# Altium schematic sheet Onju-Home.SchDoc
size A2; SheetNumber: 1; SheetTotal: 1
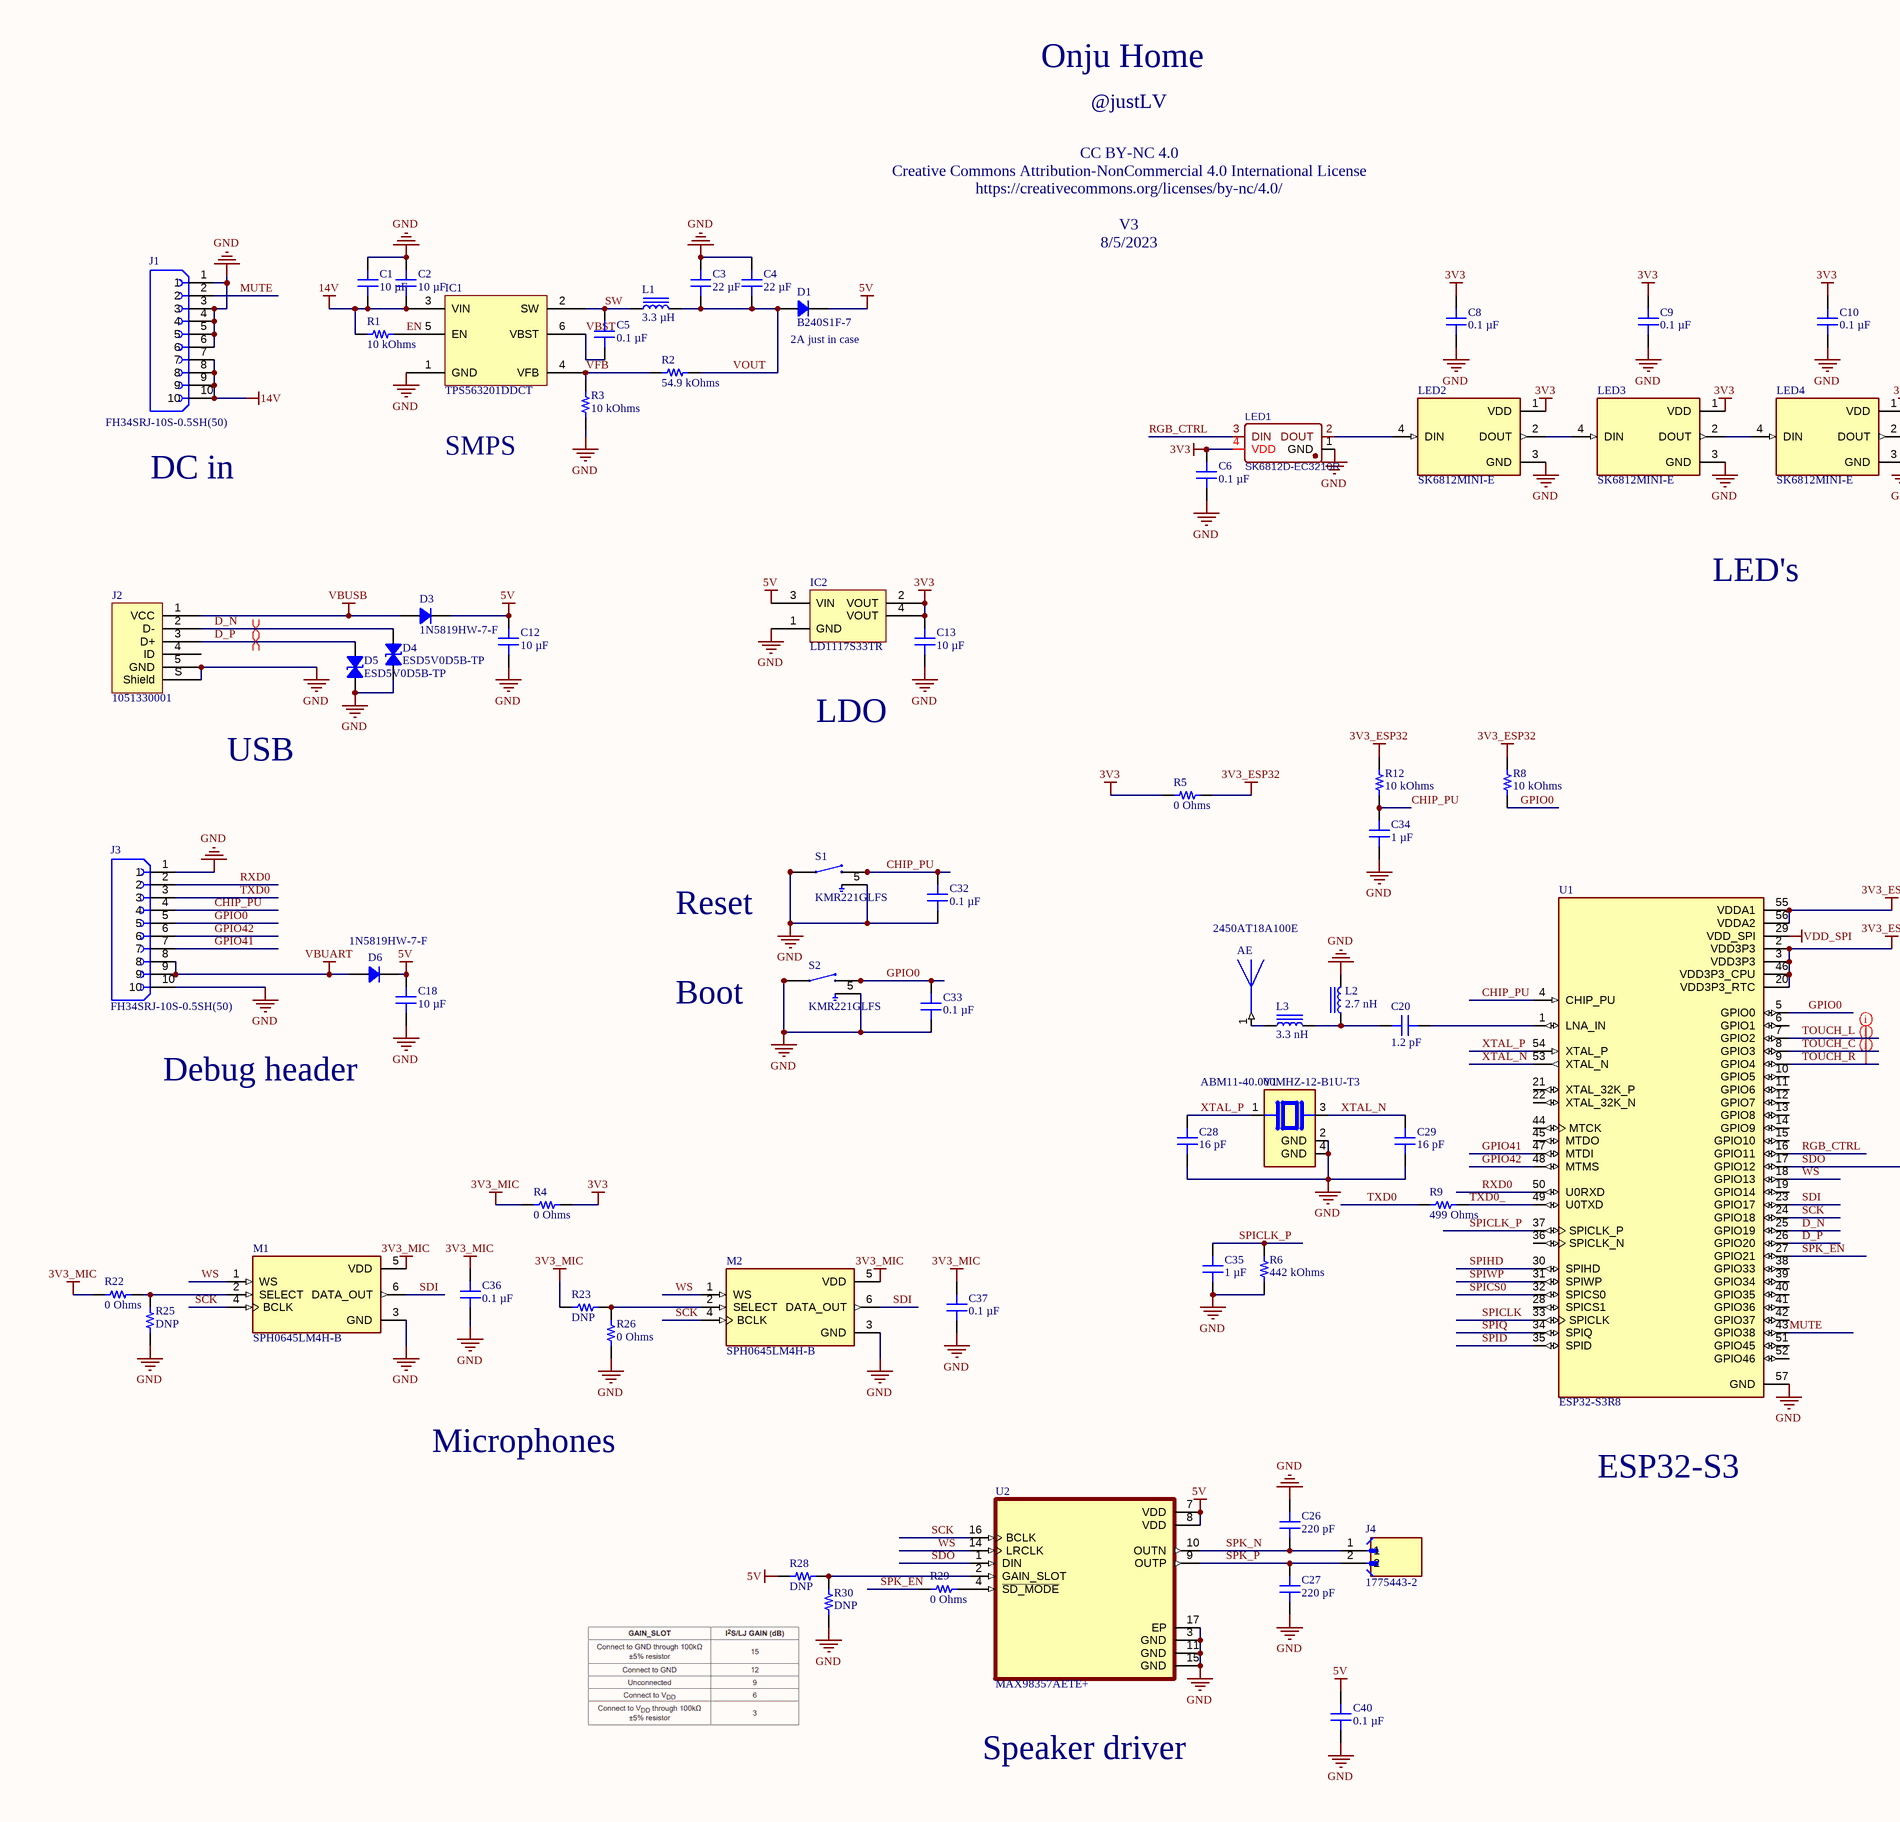
[diagram p0: Onju-Home.SchDoc, left]
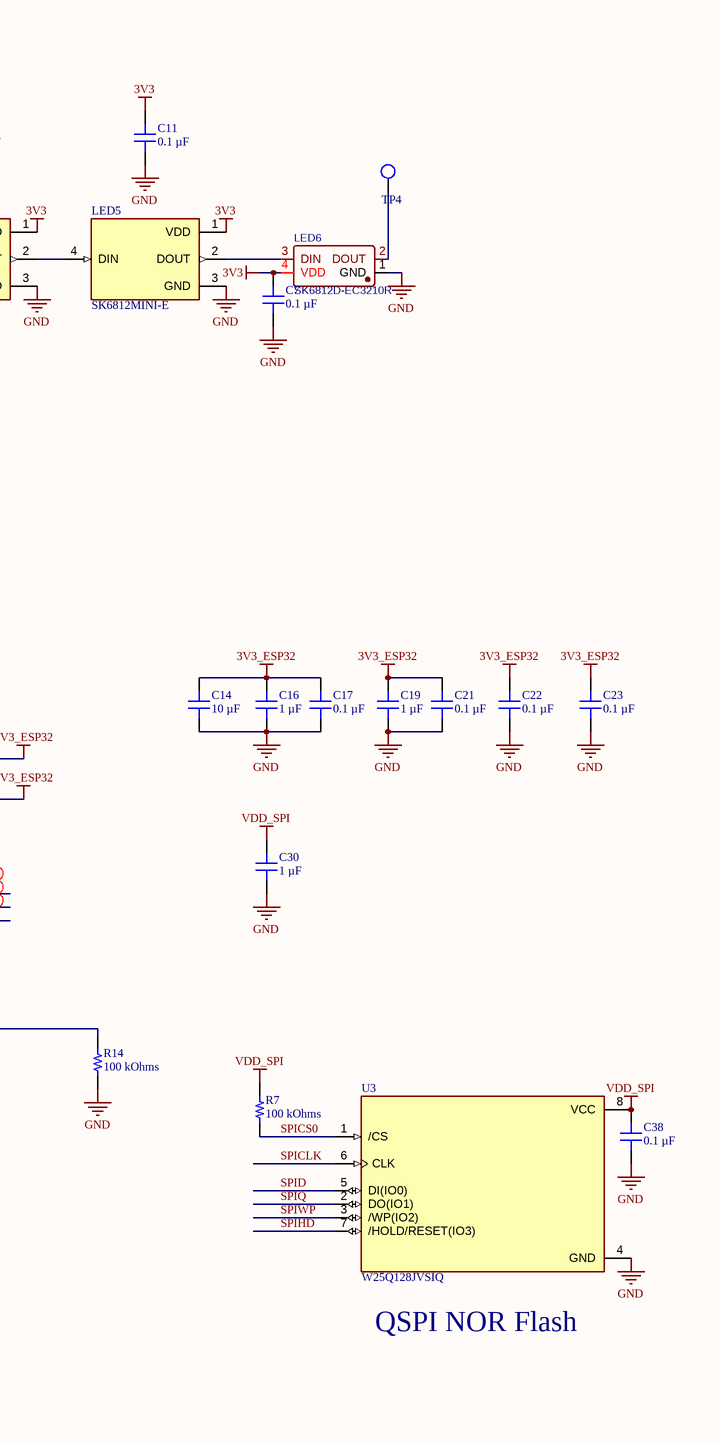
[diagram p1: Onju-Home.SchDoc, right]

## Parts
AE  2450AT18A100E  [ANTC3216X140N]
C1  10 µF  [CAP 0805_2012]
C2  10 µF  [CAP 0805_2012]
C3  22 µF  [CAP 0805_2012]
C4  22 µF  [CAP 0805_2012]
C5  0.1 µF  [CAP 0402_1005]
C6  0.1 µF  [CAP 0402_1005]
C7  0.1 µF  [CAP 0402_1005]
C8  0.1 µF  [CAP 0402_1005]
C9  0.1 µF  [CAP 0402_1005]
C10  0.1 µF  [CAP 0402_1005]
C11  0.1 µF  [CAP 0402_1005]
C12  10 µF  [CAP 0805_2012]
C13  10 µF  [CAP 0805_2012]
C14  10 µF  [CAP 0805_2012]
C16  1 µF  [CAP 0402_1005]
C17  0.1 µF  [CAP 0402_1005]
C18  10 µF  [CAP 0805_2012]
C19  1 µF  [CAP 0402_1005]
C20  1.2 pF  [CAP 0402_1005]
C21  0.1 µF  [CAP 0402_1005]
C22  0.1 µF  [CAP 0402_1005]
C23  0.1 µF  [CAP 0402_1005]
C26  220 pF  [CAP 0603_1608]
C27  220 pF  [CAP 0603_1608]
C28  16 pF  [CAP 0402_1005]
C29  16 pF  [CAP 0402_1005]
C30  1 µF  [CAP 0402_1005]
C32  0.1 µF  [CAP 0402_1005]
C33  0.1 µF  [CAP 0402_1005]
C34  1 µF  [CAP 0402_1005]
C35  1 µF  [CAP 0402_1005]
C36  0.1 µF  [CAP 0402_1005]
C37  0.1 µF  [CAP 0402_1005]
C38  0.1 µF  [CAP 0402_1005]
C40  0.1 µF  [CAP 0402_1005]
D1  B240S1F-7  [SOD123F]
D3  1N5819HW-7-F  [SOD-123]
D4  ESD5V0D5B-TP  [SOD523F]
D5  ESD5V0D5B-TP  [SOD523F]
D6  1N5819HW-7-F  [SOD-123]
IC1  TPS563201DDCT  [TI SOT-23-6 DDC]
IC2  LD1117S33TR  [ST SOT-223]
J1  FH34SRJ-10S-0.5SH(50)  [HRS_FH34SRJ-10S-0.5SH(50)]
J2  1051330001  [MOLEX 1051330001]
J3  FH34SRJ-10S-0.5SH(50)  [HRS_FH34SRJ-10S-0.5SH(50)]
J4  1775443-2  [TE_1775443-2]
L1  3.3 µH  [BOURNS SRN4018]
L2  2.7 nH  [IND 0402_1005 RF WW]
L3  3.3 nH  [IND 0402_1005 RF WW]
LED1  SK6812D-EC3210R  [LED-SMD_4P_SK6812D-EC3210R]
LED2  SK6812MINI-E  [LED_SK6812-E]
LED3  SK6812MINI-E  [LED_SK6812-E]
LED4  SK6812MINI-E  [LED_SK6812-E]
LED5  SK6812MINI-E  [LED_SK6812-E]
LED6  SK6812D-EC3210R  [LED-SMD_4P_SK6812D-EC3210R]
M1  SPH0645LM4H-B  [MIC_SPH0645LM4H-B]
M2  SPH0645LM4H-B  [MIC_SPH0645LM4H-B]
R1  10 kOhms  [RES 0603_1608]
R2  54.9 kOhms  [RES 0603_1608]
R3  10 kOhms  [RES 0603_1608]
R4  0 Ohms  [RES 0603_1608]
R5  0 Ohms  [RES 0603_1608]
R6  442 kOhms  [RES 0603_1608]
R7  100 kOhms  [RES 0603_1608]
R8  10 kOhms  [RES 0603_1608]
R9  499 Ohms  [RES 0402_1005]
R12  10 kOhms  [RES 0603_1608]
R14  100 kOhms  [RES 0603_1608]
R22  0 Ohms  [RES 0603_1608]
R23  DNP  [RES 0603_1608]  (no BOM)
R25  DNP  [RES 0603_1608]  (no BOM)
R26  0 Ohms  [RES 0603_1608]
R28  DNP  [RES 0603_1608]  (no BOM)
R29  0 Ohms  [RES 0603_1608]
R30  DNP  [RES 0603_1608]  (no BOM)
S1  KMR221GLFS  [SW_KMR221GLFS]
S2  KMR221GLFS  [SW_KMR221GLFS]
TP4  TP  [TP_1MM]  (value not drawn)  (no BOM)
U1  ESP32-S3R8  [QFN40P700X700X90-57N]
U2  MAX98357AETE+  [QFN50P300X300X80-17N]
U3  W25Q128JVSIQ  [SOIC127P790X216-8N]
Y1  ABM11-40.000MHZ-12-B1U-T3  [XTAL_ABM11-40.000MHZ-12-B1U-T3]

## Nets
3V3: C6.2 C7.2 C8.2 C9.2 C10.2 C11.2 C13.1 IC2.2(VOUT) IC2.4(VOUT) LED1.4(VDD) LED2.1(VDD) LED3.1(VDD) LED4.1(VDD) LED5.1(VDD) LED6.4(VDD) R4.2 R5.1
3V3_ESP32: C14.1 C16.2 C17.2 C19.2 C21.2 C22.2 C23.2 R5.2 R8.1 R12.1 U1.2(VDD3P3) U1.3(VDD3P3) U1.20(VDD3P3_RTC) U1.46(VDD3P3_CPU) U1.55(VDDA1) U1.56(VDDA2)
3V3_MIC: C36.2 C37.2 M1.5(VDD) M2.5(VDD) R4.1 R22.1 R23.2
5V: C12.1 C18.1 C40.2 D1.2 D3.2 D6.2 IC2.3(VIN) R28.2 U2.7(VDD) U2.8(VDD)
14V: C1.1 C2.1 IC1.3(VIN) J1.7 J1.8 J1.9 J1.10 R1.2
GND: C1.2 C2.2 C3.2 C4.2 C6.1 C7.1 C8.1 C9.1 C10.1 C11.1 C12.2 C13.2 C14.2 C16.1 C17.1 C18.2 C19.1 C21.1 C22.1 C23.1 C26.2 C27.1 C28.1 C29.1 C30.1 C32.1 C33.1 C34.1 C35.1 C36.1 C37.1 C38.1 C40.1 D4.1 D5.1 IC1.1(GND) IC2.1(GND) J1.1 J1.3 J1.4 J1.5 J1.6 J2.5(GND) J2.S(Shield) J3.1 J3.10 L2.2 LED1.1(GND) LED2.3(GND) LED3.3(GND) LED4.3(GND) LED5.3(GND) LED6.1(GND) M1.3(GND) M2.3(GND) R3.1 R6.1 R14.2 R25.1 R26.1 R30.1 S1.1 S1.4 S1.5 S2.1 S2.4 S2.5 U1.57(GND) U2.3(GND) U2.11(GND) U2.15(GND) U2.17(EP) U3.4(GND) Y1.2(GND) Y1.4(GND)
VBUART: D6.1 J3.8 J3.9
VBUSB: D3.1 J2.1(VCC)
VDD_SPI: C30.2 C38.2 R7.1 U1.29(VDD_SPI) U3.8(VCC)
CHIP_PU: C32.2 C34.2 J3.4 R12.2 S1.2 S1.3 U1.4(CHIP_PU)
D_N: D4.2 J2.2(D-) U1.25(GPIO19)
D_P: D5.2 J2.3(D+) U1.26(GPIO20)
EN: IC1.5(EN) R1.1
GPIO0: C33.2 J3.5 R8.2 S2.2 S2.3 U1.5(GPIO0)
GPIO41: J3.7 U1.47(MTDI)
GPIO42: J3.6 U1.48(MTMS)
MUTE: J1.2 U1.43(GPIO38)
RGB_CTRL: LED1.3(DIN) U1.16(GPIO11)
RXD0: J3.2 U1.50(U0RXD)
SCK: M1.4(BCLK) M2.4(BCLK) U1.24(GPIO18) U2.16(BCLK)
SDI: M1.6(DATA_OUT) M2.6(DATA_OUT) U1.23(GPIO17)
SDO: R14.1 U1.17(GPIO12) U2.1(DIN)
SPICLK: U1.33(SPICLK) U3.6(CLK)
SPICLK_P: C35.2 R6.2 U1.37(SPICLK_P)
SPICS0: R7.2 U1.32(SPICS0) U3.1(/CS)
SPID: U1.35(SPID) U3.5(DI(IO0))
SPIHD: U1.30(SPIHD) U3.7(/HOLD/RESET(IO3))
SPIQ: U1.34(SPIQ) U3.2(DO(IO1))
SPIWP: U1.31(SPIWP) U3.3(/WP(IO2))
SPK_EN: R29.1 U1.27(GPIO21)
SPK_N: C26.1 J4.1 U2.10(OUTN)
SPK_P: C27.2 J4.2 U2.9(OUTP)
SW: C5.2 IC1.2(SW) L1.1
TOUCH_C: U1.8(GPIO3)
TOUCH_L: U1.7(GPIO2)
TOUCH_R: U1.9(GPIO4)
TXD0: J3.3 R9.1
TXD0_: R9.2 U1.49(U0TXD)
VBST: C5.1 IC1.6(VBST)
VFB: IC1.4(VFB) R2.1 R3.2
VOUT: C3.1 C4.1 D1.1 L1.2 R2.2
WS: M1.1(WS) M2.1(WS) U1.18(GPIO13) U2.14(LRCLK)
XTAL_N: C29.2 U1.53(XTAL_N) Y1.3
XTAL_P: C28.2 U1.54(XTAL_P) Y1.1
NetAE_1: AE.1 L3.1
NetC20_1: C20.1 L2.1 L3.2
NetC20_2: C20.2 U1.1(LNA_IN)
NetLED1_2: LED1.2(DOUT) LED2.4(DIN)
NetLED2_2: LED2.2(DOUT) LED3.4(DIN)
NetLED3_2: LED3.2(DOUT) LED4.4(DIN)
NetLED4_2: LED4.2(DOUT) LED5.4(DIN)
NetLED5_2: LED5.2(DOUT) LED6.3(DIN)
NetLED6_2: LED6.2(DOUT) TP4.1
NetM1_2: M1.2(SELECT) R22.2 R25.2
NetM2_2: M2.2(SELECT) R23.1 R26.2
NetR28_1: R28.1 R30.2 U2.2(GAIN_SLOT)
NetR29_2: R29.2 U2.4(~{SD_MODE})

Not connected (* = marked no-connect by the designer): J2 4(ID); U1 6(GPIO1) 10(GPIO5) 11(GPIO6) 12(GPIO7) 13(GPIO8) 14(GPIO9) 15(GPIO10) 19(GPIO14) 21(XTAL_32K_P) 22(XTAL_32K_N) 28(SPICS1) 36(SPICLK_N) 38(GPIO33) 39(GPIO34) 40(GPIO35) 41(GPIO36) 42(GPIO37) 44(MTCK) 45(MTDO) 51(GPIO45) 52(GPIO46)

## Layout directives
differential pair: D_N, D_P
net class touch: TOUCH_C, TOUCH_L, TOUCH_R

## Notes on the sheet
- Onju Home
- @justLV
- CC BY-NC 4.0
  Creative Commons Attribution-NonCommercial 4.0 International License
  https://creativecommons.org/licenses/by-nc/4.0/
  V3
  8/5/2023
- (near D1) 2A just in case
- SMPS
- DC in
- LED's
- USB
- LDO
- Reset
- Boot
- Debug header
- Microphones
- ESP32-S3
- (near U3) QSPI NOR Flash
- Speaker driver
- THIS DOCUMENT AND THE DATA DISCLOSED HEREIN OR
- HEREWITH IS THE PROPERTY OF ALTIUM LIMITED AND MAY
- DWG NO:
- REVISION
- REV:
- DESCRIPTION
- DATE
- APPROVED
- BE FREELY DISTRIBUTED IN WHOLE. NO RIGHTS ARE
- RESERVED OR EXPRESS OR IMPLIED WARANTEE GIVEN.
- ENG:
- APPROVALS
- PROJECT
- DSN:
- CHK:
- REFERENCE DOCUMENTS
- PROJECT REVISION:
- TITLE
- DOCUMENT REVISION:
- DESIGN ITEM:
- BOM:
- FAB DWG:
- PCB DWG:
- ASSY DWG:
- SCALE:
- A3
- SIZE
- CAGE CODE
- FILE NAME
- DWG NO.
- SHEET
- OF
- REV

## Library data of the parts
AE = 2450AT18A100E: 2.4GHz Chip RF Antenna 2.4GHz ~ 2.5GHz 0.5dBi Solder Surface Mount; MF: Johanson Technology; Price: None; SnapEDA_Link: https://www.snapeda.com/parts/2450AT18A100E/Johanson%20Technology%20Inc./view-part/267154/?ref=snap; Package: FBGA-780 Johanson; Availability: Unavailable; Value: *; MP: 2450AT18A100E; manufacturer: Johanson Technology; Part Number: 2450AT18A100E; JLC part number: C89334
C1 C2 C12-C14 C18 = CL21A106KOQNNNE: CAP CER 10UF 16V X5R 0805; manufacturer: Samsung Electro-Mechanics; Tolerance: ±10%; Part Number: CL21A106KOQNNNE; Value: 10 µF; Applications: General Purpose; Capacitance: 10 µF; componentlink1description: Datasheet; componentlink1url: http://www.samsungsem.com/kr/support/product-search/mlcc/CL21A106KOQNNNE.jsp; componentlink2description: DigiKey Link; componentlink2url: https://www.digikey.com/en/products/detail/samsung-electro-mechanics/CL21A106KOQNNNE/3886754; Device Package: 0805 (2012 Metric); lastupdated: 5/18/2023 7:18:21 PM; Lifecycle Status: Active; Minimum Order: 1; Mounting Type: Surface Mount, MLCC; Operating Temperature: -55°C ~ 85°C; Package / Case: 0805 (2012 Metric); packaging: TapeAndReel; partid: 14297; Part Status: Active; price: 0.01; series: CL; Size / Dimension: 0.079" L x 0.049" W (2.00mm x 1.25mm); Supplier 1: DigiKey; Supplier Part Number 1: 1276-1096-1-ND; Temperature Coefficient: X5R; Thickness (Max): 0.055" (1.40mm); Voltage - Rated: 16V; JLC part number: C1713
C3 C4 = CL21A226MAYNNNE: CAP CER 22UF 25V X5R 0805; manufacturer: Samsung Electro-Mechanics; Tolerance: ±20%; Part Number: CL21A226MAYNNNE; Value: 22 µF; Applications: General Purpose; Capacitance: 22 µF; componentlink1description: Datasheet; componentlink1url: https://media.digikey.com/pdf/Data%20Sheets/Samsung%20PDFs/CL21A226MAYNNNE_Spec.pdf; componentlink2description: DigiKey Link; componentlink2url: https://www.digikey.com/en/products/detail/samsung-electro-mechanics/CL21A226MAYNNNE/10479857; Device Package: 0805 (2012 Metric); lastupdated: 5/18/2023 7:17:22 PM; Lifecycle Status: Active; Minimum Order: 1; Mounting Type: Surface Mount, MLCC; Operating Temperature: -55°C ~ 85°C; Package / Case: 0805 (2012 Metric); packaging: TapeAndReel; partid: 39209; Part Status: Active; price: 0.04; series: CL; Size / Dimension: 0.079" L x 0.049" W (2.00mm x 1.25mm); Supplier 1: DigiKey; Supplier Part Number 1: 1276-CL21A226MAYNNNECT-ND; Temperature Coefficient: X5R; Thickness (Max): 0.057" (1.45mm); Voltage - Rated: 25V; JLC part number: C602037
C5-C11 C17 C21-C23 C32 C33 C36-C38 C40 = CL05A104KA5NNNC: CAP CER 0.1UF 25V X5R 0402; manufacturer: Samsung Electro-Mechanics; Tolerance: ±10%; Part Number: CL05A104KA5NNNC; Value: 0.1 µF; Applications: General Purpose; Capacitance: 0.1 µF; componentlink1description: Datasheet; componentlink1url: http://www.samsungsem.com/kr/support/product-search/mlcc/CL05A104KA5NNNC.jsp; componentlink2description: DigiKey Link; componentlink2url: https://www.digikey.com/en/products/detail/samsung-electro-mechanics/CL05A104KA5NNNC/3886701; Device Package: 0402 (1005 Metric); lastupdated: 6/8/2023 7:05:37 PM; Lifecycle Status: Active; Minimum Order: 1; Mounting Type: Surface Mount, MLCC; Operating Temperature: -55°C ~ 85°C; Package / Case: 0402 (1005 Metric); packaging: CutTape; partid: 6090; Part Status: Active; price: 0.01; series: CL; Size / Dimension: 0.039" L x 0.020" W (1.00mm x 0.50mm); Supplier 1: DigiKey; Supplier Part Number 1: 1276-1043-1-ND; Temperature Coefficient: X5R; Thickness (Max): 0.022" (0.55mm); Voltage - Rated: 25V; JLC part number: C307331
C16 C19 C30 C34 C35 = GRM155R61E105MA12J: CAP CER 1UF 25V X5R 0402; manufacturer: Murata Electronics; Tolerance: ±20%; Part Number: GRM155R61E105MA12J; Value: 1 µF; Applications: General Purpose; Capacitance: 1 µF; componentlink1description: Datasheet; componentlink1url: https://search.murata.co.jp/Ceramy/image/img/A01X/G101/ENG/GRM155R61E105MA12-01A.pdf; componentlink2description: DigiKey Link; componentlink2url: https://www.digikey.com/en/products/detail/murata-electronics/GRM155R61E105MA12J/16033918; Device Package: 0402 (1005 Metric); lastupdated: 6/8/2023 7:04:55 PM; Lifecycle Status: Active; Minimum Order: 1; Mounting Type: Surface Mount, MLCC; Operating Temperature: -55°C ~ 85°C; Package / Case: 0402 (1005 Metric); packaging: TapeAndReel; partid: 40853; Part Status: Active; price: 0.01; series: GRM; Size / Dimension: 0.039" L x 0.020" W (1.00mm x 0.50mm); Supplier 1: DigiKey; Supplier Part Number 1: 490-GRM155R61E105MA12JCT-ND; Temperature Coefficient: X5R; Thickness (Max): 0.022" (0.55mm); Voltage - Rated: 25V
C20 = 500R07S1R2BV4T: CAP CER 1.2PF 50V C0G/NP0 0402; manufacturer: Johanson Technology Inc.; Temperature Coefficient: C0G, NP0; Tolerance: ±0.1pF; Part Number: 500R07S1R2BV4T; Value: 1.2 pF; Applications: RF, Microwave, High Frequency; Capacitance: 1.2 pF; componentlink1description: Datasheet; componentlink1url: https://www.johansontechnology.com/downloads/catalog/johanson-technology-multi-layer-high-q-capacitors.pdf; componentlink2description: DigiKey Link; componentlink2url: https://www.digikey.com/en/products/detail/johanson-technology-inc/500R07S1R2BV4T/1561523; Device Package: 0402 (1005 Metric); Features: High Q, Low Loss, Ultra Low ESR; lastupdated: 6/8/2023 7:05:36 PM; Lifecycle Status: Active; Minimum Order: 1; Mounting Type: Surface Mount, MLCC; Operating Temperature: -55°C ~ 125°C; Package / Case: 0402 (1005 Metric); packaging: TapeAndReel; partid: 6520; Part Status: Active; price: 0.02; series: S; Size / Dimension: 0.040" L x 0.020" W (1.02mm x 0.51mm); Supplier 1: DigiKey; Supplier Part Number 1: 712-1268-1-ND; Thickness (Max): 0.024" (0.61mm); Voltage - Rated: 50V; JLC part number: C1551
C26 C27 = CL10B221KB8NFNC: CAP CER 220PF 50V X7R 0603; manufacturer: Samsung Electro-Mechanics; Tolerance: ±10%; Part Number: CL10B221KB8NFNC; Value: 220 pF; Applications: General Purpose; Capacitance: 220 pF; componentlink1description: Datasheet; componentlink1url: http://www.samsungsem.com/kr/support/product-search/mlcc/CL10B221KB8NFNC.jsp; componentlink2description: DigiKey Link; componentlink2url: https://www.digikey.com/en/products/detail/samsung-electro-mechanics/CL10B221KB8NFNC/3887644; Device Package: 0603 (1608 Metric); lastupdated: 5/18/2023 7:12:41 PM; Lifecycle Status: Active; Minimum Order: 1; Mounting Type: Surface Mount, MLCC; Operating Temperature: -55°C ~ 125°C; Package / Case: 0603 (1608 Metric); packaging: TapeAndReel; partid: 3570; Part Status: Active; price: 0.01; series: CL; Size / Dimension: 0.063" L x 0.031" W (1.60mm x 0.80mm); Supplier 1: DigiKey; Supplier Part Number 1: 1276-1986-1-ND; Temperature Coefficient: X7R; Thickness (Max): 0.035" (0.90mm); Voltage - Rated: 50V; JLC part number: C1603
C28 C29 = GCM1555C1H160FA16D: CAP CER 16PF 50V C0G/NP0 0402; manufacturer: Murata Electronics; Temperature Coefficient: C0G, NP0; Tolerance: ±1%; Part Number: GCM1555C1H160FA16D; Value: 16 pF; Applications: Automotive; Capacitance: 16 pF; componentlink1description: Datasheet; componentlink1url: https://search.murata.co.jp/Ceramy/image/img/A01X/G101/ENG/GCM1555C1H160FA16-01.pdf; componentlink2description: DigiKey Link; componentlink2url: https://www.digikey.com/en/products/detail/murata-electronics/GCM1555C1H160FA16D/16033389; Device Package: 0402 (1005 Metric); lastupdated: 6/9/2023 7:04:45 PM; Lifecycle Status: Active; Minimum Order: 1; Mounting Type: Surface Mount, MLCC; Operating Temperature: -55°C ~ 125°C; Package / Case: 0402 (1005 Metric); packaging: TapeAndReel; partid: 41095; Part Status: Active; price: 0.01; Ratings: AEC-Q200; series: GCM; Size / Dimension: 0.039" L x 0.020" W (1.00mm x 0.50mm); Supplier 1: DigiKey; Supplier Part Number 1: 490-GCM1555C1H160FA16DCT-ND; Thickness (Max): 0.022" (0.55mm); Voltage - Rated: 50V
D1 = B240S1F-7: DIODE SCHOTTKY 40V 2A SOD123F; Manufacturer: Diodes Incorporated; Capacitance @ Vr, F: 100pF @ 4V, 1MHz; Current - Reverse Leakage @ Vr: 200 µA @ 40 V; Speed: Fast Recovery =< 500ns, > 200mA (Io); Voltage - Forward (Vf) (Max) @ If: 500 mV @ 2 A; Part Number: B240S1F-7; ComponentLink1Description: Datasheet; ComponentLink1URL: https://www.diodes.com/assets/Datasheets/B240S1F.pdf; ComponentLink2Description: DigiKey Link; ComponentLink2URL: https://www.digikey.com/en/products/detail/diodes-incorporated/B240S1F-7/7666757; Current - Average Rectified (Io): 2A; Diode Type: Schottky; LastUpdated: 5/19/2023 8:24:02 PM; Lifecycle Status: Active; Minimum Order: 1; Mounting Type: Surface Mount; Operating Temperature - Junction: -55°C ~ 150°C; Package / Case: SOD-123F; Packaging: TapeAndReel; PartId: 2372; Part Status: Active; Price: 0.05; Series: -; Supplier 1: DigiKey; Supplier Part Number 1: B240S1F-7DICT-ND; Supplier Device Package: SOD-123F; Voltage - DC Reverse (Vr) (Max): 40 V; JLC part number: C3001607
D3 D6 = 1N5819HW-7-F: DIODE SCHOTTKY 40V 1A SOD123; Manufacturer: Diodes Incorporated; Capacitance @ Vr, F: 60pF @ 4V, 1MHz; Current - Reverse Leakage @ Vr: 1 mA @ 40 V; Speed: Fast Recovery =< 500ns, > 200mA (Io); Voltage - Forward (Vf) (Max) @ If: 450 mV @ 1 A; Part Number: 1N5819HW-7-F; ComponentLink1Description: Datasheet; ComponentLink1URL: https://www.diodes.com/assets/Datasheets/ds30217.pdf; ComponentLink2Description: DigiKey Link; ComponentLink2URL: https://www.digikey.com/en/products/detail/diodes-incorporated/1N5819HW-7-F/814970; Current - Average Rectified (Io): 1A; Diode Type: Schottky; LastUpdated: 5/18/2023 8:19:19 PM; Lifecycle Status: Active; Minimum Order: 1; Mounting Type: Surface Mount; Operating Temperature - Junction: -65°C ~ 125°C; Package / Case: SOD-123; Packaging: TapeAndReel; PartId: 2212; Part Status: Active; Price: 0.05; Series: -; Supplier 1: DigiKey; Supplier Part Number 1: 1N5819HW-FDICT-ND; Supplier Device Package: SOD-123; Voltage - DC Reverse (Vr) (Max): 40 V; JLC part number: C82544
D4 D5 = ESD5V0D5B-TP: TVS DIODE 5VWM 13VC SOD523; Part Number: ESD5V0D5B-TP
IC1 = TPS563201DDCT: IC REG BUCK ADJ 3A TSOT23-6; Manufacturer: Texas Instruments; Frequency - Switching: 580kHz; Function: Step-Down; Number of Outputs: 1; Output Configuration: Positive; Output Type: Adjustable; Synchronous Rectifier: Yes; Voltage - Input (Max): 17V; Voltage - Input (Min): 4.5V; Voltage - Output (Max): 7V; Voltage - Output (Min/Fixed): 0.768V; Part Number: TPS563201DDCT; ComponentLink1Description: Datasheet; ComponentLink1URL: http://www.ti.com/general/docs/suppproductinfo.tsp?distId=10&gotoUrl=http%3A%2F%2Fwww.ti.com%2Flit%2Fgpn%2Ftps563201; ComponentLink2Description: DigiKey Link; ComponentLink2URL: //digikey.com/product-detail/en/texas-instruments/TPS563201DDCT/296-43393-2-ND/5813458; Current - Output: 3A; Device Package: SOT-23-6 Thin, TSOT-23-6; LastUpdated: 12/12/2019 10:07:22 AM; Lifecycle Status: 0; Minimum Order: 1; Mounting Type: Surface Mount; Operating Temperature: -40°C ~ 125°C (TJ); Package / Case: SOT-23-6 Thin, TSOT-23-6; Packaging: TapeAndReel; Part Status: Active; Price: 0.54; Series: D-CAP2™, Eco-Mode™; Supplier 1: DigiKey; Supplier Part Number 1: 296-43393-2-ND; Supplier Device Package: TSOT-23-6; Topology: Buck
IC2 = LD1117S33TR: IC REG LINEAR 3.3V 800MA SOT223; Manufacturer: STMicroelectronics; Current - Quiescent (Iq): 10 mA; Number of Regulators: 1; Output Configuration: Positive; Output Type: Fixed; Protection Features: Over Current, Over Temperature; PSRR: 75dB (120Hz); Voltage Dropout (Max): 1.2V @ 800mA; Voltage - Input (Max): 15V; Part Number: LD1117S33TR; ComponentLink1Description: Datasheet; ComponentLink1URL: http://www.st.com/content/ccc/resource/technical/document/datasheet/99/3b/7d/91/91/51/4b/be/CD00000544.pdf/files/CD00000544.pdf/jcr:content/translations/en.CD00000544.pdf; ComponentLink2Description: DigiKey Link; ComponentLink2URL: https://www.digikey.com/en/products/detail/stmicroelectronics/LD1117S33TR/585766; Current - Output: 800mA; LastUpdated: 5/17/2023 8:49:58 PM; Lifecycle Status: Active; Minimum Order: 1; Mounting Type: Surface Mount; Operating Temperature: 0°C ~ 125°C; Package / Case: TO-261-4, TO-261AA; Packaging: TapeAndReel; Part Status: Active; Price: 0.21; Series: -; Supplier 1: DigiKey; Supplier Part Number 1: 497-1242-1-ND; Supplier Device Package: SOT-223; Voltage - Output (Min/Fixed): 3.3V
J1 J3 = FH34SRJ-10S-0.5SH(50): manufacturer: Hirose; Availability: Unavailable; Price: None; Package: None; Value: *; MP: FH34SRJ-10S-0.5SH(50); Part Number: FH34SRJ-10S-0.5SH(50)
J2 = 1051330001: CONN RCPT USB2.0 MICRO B SMD; Manufacturer: Molex; Connector Type: USB - micro B; Current Rating (Amps): 1A, 1.8A; Gender: Receptacle; Mating Cycles: 10000; Number of Contacts: 5; Number of Ports: 1; Shielding: Shielded; Voltage - Rated: 30VAC; Part Number: 1051330001; ComponentLink1Description: Datasheet; ComponentLink1URL: https://www.molex.com/pdm_docs/sd/1051330001_sd.pdf; ComponentLink2Description: DigiKey Link; ComponentLink2URL: http://digikey.com/product-detail/en/molex/1051330001/WM9734CT-ND/4037910; Features: Pick and Place; LastUpdated: 6/6/2020 2:11:37 AM; Lifecycle Status: Active; Minimum Order: 1; Mounting Feature: Vertical; Mounting Type: Surface Mount; Operating Temperature: -35°C ~ 85°C; Packaging: TapeAndReel; Part Status: Active; Price: 0.63; Series: 105133; Specifications: USB 2.0; Supplier 1: DigiKey; Supplier Part Number 1: WM9734CT-ND; Termination: Solder
J4 = 1775443-2: EMIX CONN., 1.5MM PITCH, HDR, V/T, 2P; MF: TE Connectivity; Product_Type: Connector; Number_of_Positions: 2; Centerline_Pitch: 1.5 mm[.059 in]; Package: None; Price: None; Check_prices: https://www.snapeda.com/parts/1775443-2/TE+Connectivity/view-part/?ref=eda; Value: *; SnapEDA_Link: https://www.snapeda.com/parts/1775443-2/TE+Connectivity/view-part/?ref=snap; MP: 1775443-2; EU_RoHS_Compliance: Compliant; Availability: In Stock; Purchase-URL: https://pricing.snapeda.com/search?q=1775443-2&ref=eda
L1 = SRN4018-3R3M: FIXED IND 3.3UH 2.2A 66 MOHM SMD; Manufacturer: Bourns Inc.; Current - Saturation: 2.3A; DC Resistance (DCR): 66mOhm Max; Frequency - Self Resonant: 45MHz; Inductance Frequency - Test: 100 kHz; Material - Core: Ferrite; Q @ Freq: 9 @ 7.96MHz; Shielding: Semi-Shielded; Tolerance: ±20%; Type: Drum Core, Wirewound; Part Number: SRN4018-3R3M; ComponentLink1Description: Datasheet; ComponentLink1URL: https://www.bourns.com/docs/Product-Datasheets/SRN4018.pdf; ComponentLink2Description: DigiKey Link; ComponentLink2URL: https://www.digikey.com/en/products/detail/bourns-inc/SRN4018-3R3M/3821621; Current Rating (Amps): 2.2 A; Device Package: Nonstandard; Height - Seated (Max): 0.071" (1.80mm); Inductance: 3.3 µH; LastUpdated: 5/18/2023 9:02:40 PM; Lifecycle Status: Active; Minimum Order: 1; Mounting Type: Surface Mount; Operating Temperature: -40°C ~ 125°C; Package / Case: Nonstandard; Packaging: TapeAndReel; PartId: 3648; Part Status: Active; Price: 0.18; Series: SRN4018; Size / Dimension: 0.157" L x 0.157" W (4.00mm x 4.00mm); Supplier 1: DigiKey; Supplier Part Number 1: SRN4018-3R3MCT-ND; Value: 3.3 µH
L2 = LQW15AN2N7C8ZD: FIXED IND 2.7NH 1.5A 47MOHM SMD; Manufacturer: Murata Electronics; DC Resistance (DCR): 47mOhm Max; Frequency - Self Resonant: 14GHz; Inductance Frequency - Test: 100 MHz; Material - Core: Non-Magnetic; Q @ Freq: 28 @ 250MHz; Shielding: Unshielded; Tolerance: ±0.2nH; Type: Wirewound; Part Number: LQW15AN2N7C8ZD; ComponentLink1Description: Datasheet; ComponentLink1URL: https://search.murata.co.jp/Ceramy/image/img/P02/JELF243A-9138.pdf; ComponentLink2Description: DigiKey Link; ComponentLink2URL: https://www.digikey.com/en/products/detail/murata-electronics/LQW15AN2N7C8ZD/6798821; Current Rating (Amps): 1.5 A; Device Package: 0402 (1005 Metric); Height - Seated (Max): 0.024" (0.60mm); Inductance: 2.7 nH; LastUpdated: 6/8/2023 8:38:37 PM; Lifecycle Status: Active; Minimum Order: 1; Mounting Type: Surface Mount; Operating Temperature: -55°C ~ 125°C; Package / Case: 0402 (1005 Metric); Packaging: TapeAndReel; PartId: 547; Part Status: Active; Price: 0.07; Ratings: AEC-Q200; Series: LQW15; Size / Dimension: 0.039" L x 0.024" W (1.00mm x 0.60mm); Supplier 1: DigiKey; Supplier Part Number 1: 490-15396-1-ND; Supplier Device Package: 0402 (1005 Metric); Value: 2.7 nH; JLC part number: C91239
L3 = LQW15AN3N3C80D: FIXED IND 3.3NH 2A 30 MOHM SMD; Manufacturer: Murata Electronics; DC Resistance (DCR): 30mOhm Max; Frequency - Self Resonant: 14GHz; Inductance Frequency - Test: 100 MHz; Material - Core: Non-Magnetic; Q @ Freq: 30 @ 250MHz; Shielding: Unshielded; Tolerance: ±0.2nH; Type: Wirewound; Part Number: LQW15AN3N3C80D; ComponentLink1Description: Datasheet; ComponentLink1URL: https://search.murata.co.jp/Ceramy/image/img/P02/JELF243A-0100.pdf; ComponentLink2Description: DigiKey Link; ComponentLink2URL: https://www.digikey.com/en/products/detail/murata-electronics/LQW15AN3N3C80D/4292355; Current Rating (Amps): 2 A; Device Package: 0402 (1005 Metric); Height - Seated (Max): 0.024" (0.60mm); Inductance: 3.3 nH; LastUpdated: 6/8/2023 8:38:36 PM; Lifecycle Status: Active; Minimum Order: 1; Mounting Type: Surface Mount; Operating Temperature: -55°C ~ 125°C; Package / Case: 0402 (1005 Metric); Packaging: TapeAndReel; PartId: 597; Part Status: Active; Price: 0.06; Series: LQW15; Size / Dimension: 0.039" L x 0.024" W (1.00mm x 0.60mm); Supplier 1: DigiKey; Supplier Part Number 1: 490-7642-1-ND; Value: 3.3 nH
LED1 LED6 = SK6812D-EC3210R: BOM_Manufacturer: 欧思科光电; manufacturer: OPSCO Optoelectronics; Contributor: LCSC; BOM_Supplier: LCSC; BOM_Supplier Part: C2890041; BOM_Manufacturer Part: SK6812D-EC3210R; BOM_JLCPCB Part Class: Extended Part; spicePre: L; spiceSymbolName: SK6812D-EC3210R; Part Number: SK6812D-EC3210R; JLC part number: C2890041
LED2-LED5 = SK6812MINI-E: SK6812MINI-E SMD RGB LED; MF: DONGGUANG OPSCO OPTOELECTRONICS CO., LTD; MP: Sk6812-E; Package: Package; Price: None; Value: *; SnapEDA_Link: https://www.snapeda.com/parts/Sk6812-E/DONGGUANG+OPSCO+OPTOELECTRONICS+CO.%252C+LTD/view-part/?ref=snap; Availability: Not in stock; Check_prices: https://www.snapeda.com/parts/Sk6812-E/DONGGUANG+OPSCO+OPTOELECTRONICS+CO.%252C+LTD/view-part/?ref=eda
M1 M2 = SPH0645LM4H-B: 20 Hz ~ 10 kHz digitale IÂ²S-Mikrofon-MEMS _Silizium_ 1,62 V ~ 3,6 V omnidirektionale _-26 dB Â± 3 dB bei 94 dB SPL_ LÃ¶tpads; MF: Knowles; Package: SIP-7 Bourns; Digi-Key_Purchase_URL: https://www.digikey.ch/product-detail/en/knowles/SPH0645LM4H-B/423-1405-1-ND/5332432?utm_source=snapeda&utm_medium=aggregator&utm_campaign=symbol; Digi-Key_Part_Number: 423-1405-1-ND; SnapEDA_Link: https://www.snapeda.com/parts/SPH0645LM4H-B/Knowles/view-part/229820/?ref=snap; MP: SPH0645LM4H-B; Value: *; manufacturer: Knowles; Part Number: SPH0645LM4H-B
R1 R3 R8 R12 = RC0603FR-1010KL: RES 10K OHM 1% 1/10W 0603; Manufacturer: Yageo; Power (Watts): 0.1W, 1/10W; Temperature Coefficient: ±100ppm/°C; Part Number: RC0603FR-1010KL; Value: 10 kOhms; ComponentLink1Description: Datasheet; ComponentLink1URL: https://www.yageo.com/upload/media/product/productsearch/datasheet/rchip/PYu-RC_Group_51_RoHS_L_11.pdf; ComponentLink2Description: DigiKey Link; ComponentLink2URL: https://www.digikey.com/en/products/detail/yageo/RC0603FR-1010KL/12756395; Composition: Thick Film; Device Package: 0603 (1608 Metric); Features: Moisture Resistant; Height - Seated (Max): 0.022" (0.55mm); LastUpdated: 5/18/2023 7:40:33 PM; Lifecycle Status: Active; Minimum Order: 1; Number of Terminations: 2; Operating Temperature: -55°C ~ 155°C; Package / Case: 0603 (1608 Metric); Packaging: CutTape; PartId: 62897; Part Status: Active; Price: 0.01; Resistance: 10 kOhms; Series: RC_L; Size / Dimension: 0.063" L x 0.031" W (1.60mm x 0.80mm); Supplier 1: DigiKey; Supplier Part Number 1: 13-RC0603FR-1010KLCT-ND; Supplier Device Package: 0603; Tolerance: ±1%
R2 = RC0603FR-0754K9L: RES 54.9K OHM 1% 1/10W 0603; Manufacturer: Yageo; Power (Watts): 0.1W, 1/10W; Temperature Coefficient: ±100ppm/°C; Part Number: RC0603FR-0754K9L; Value: 54.9 kOhms; ComponentLink1Description: Datasheet; ComponentLink1URL: https://www.yageo.com/upload/media/product/productsearch/datasheet/rchip/PYu-RC_Group_51_RoHS_L_10.pdf; ComponentLink2Description: DigiKey Link; ComponentLink2URL: https://www.digikey.com/en/products/detail/yageo/RC0603FR-0754K9L/727298; Composition: Thick Film; Device Package: 0603 (1608 Metric); Features: Moisture Resistant; Height - Seated (Max): 0.022" (0.55mm); LastUpdated: 5/19/2023 7:42:02 PM; Lifecycle Status: Active; Minimum Order: 1; Number of Terminations: 2; Operating Temperature: -55°C ~ 155°C; Package / Case: 0603 (1608 Metric); Packaging: CutTape; PartId: 12494; Part Status: Active; Price: 0.01; Resistance: 54.9 kOhms; Series: RC_L; Size / Dimension: 0.063" L x 0.031" W (1.60mm x 0.80mm); Supplier 1: DigiKey; Supplier Part Number 1: 311-54.9KHRCT-ND; Supplier Device Package: 0603; Tolerance: ±1%
R4 R5 R22 R26 R29 = RC0603JR-130RL: RES 0 OHM JUMPER 1/10W 0603; Manufacturer: Yageo; Power (Watts): 0.1W, 1/10W; Part Number: RC0603JR-130RL; Value: 0 Ohms; ComponentLink1Description: Datasheet; ComponentLink1URL: https://www.yageo.com/upload/media/product/productsearch/datasheet/rchip/PYu-RC_Group_51_RoHS_L_11.pdf; ComponentLink2Description: DigiKey Link; ComponentLink2URL: https://www.digikey.com/en/products/detail/yageo/RC0603JR-130RL/12756398; Composition: Thick Film; Device Package: 0603 (1608 Metric); Features: Moisture Resistant; Height - Seated (Max): 0.022" (0.55mm); LastUpdated: 5/18/2023 7:40:20 PM; Lifecycle Status: Active; Minimum Order: 1; Number of Terminations: 2; Operating Temperature: -55°C ~ 155°C; Package / Case: 0603 (1608 Metric); Packaging: CutTape; PartId: 65414; Part Status: Active; Price: 0.01; Resistance: 0 Ohms; Series: RC_L; Size / Dimension: 0.063" L x 0.031" W (1.60mm x 0.80mm); Supplier 1: DigiKey; Supplier Part Number 1: 13-RC0603JR-130RLCT-ND; Supplier Device Package: 0603; Tolerance: Jumper
R6 = RC0603FR-07442KL: RES 442K OHM 1% 1/10W 0603; Manufacturer: Yageo; Power (Watts): 0.1W, 1/10W; Temperature Coefficient: ±100ppm/°C; Part Number: RC0603FR-07442KL; Value: 442 kOhms; ComponentLink1Description: Datasheet; ComponentLink1URL: https://www.yageo.com/upload/media/product/productsearch/datasheet/rchip/PYu-RC_Group_51_RoHS_L_10.pdf; ComponentLink2Description: DigiKey Link; ComponentLink2URL: https://www.digikey.com/en/products/detail/yageo/RC0603FR-07442KL/727243; Composition: Thick Film; Device Package: 0603 (1608 Metric); Features: Moisture Resistant; Height - Seated (Max): 0.022" (0.55mm); LastUpdated: 6/8/2023 7:45:09 PM; Lifecycle Status: Active; Minimum Order: 1; Number of Terminations: 2; Operating Temperature: -55°C ~ 155°C; Package / Case: 0603 (1608 Metric); Packaging: CutTape; PartId: 7735; Part Status: Active; Price: 0.01; Resistance: 442 kOhms; Series: RC_L; Size / Dimension: 0.063" L x 0.031" W (1.60mm x 0.80mm); Supplier 1: DigiKey; Supplier Part Number 1: 311-442KHRCT-ND; Supplier Device Package: 0603; Tolerance: ±1%
R7 R14 = RC0603FR-07100KL: RES 100K OHM 1% 1/10W 0603; Manufacturer: Yageo; Power (Watts): 0.1W, 1/10W; Temperature Coefficient: ±100ppm/°C; Part Number: RC0603FR-07100KL; Value: 100 kOhms; ComponentLink1Description: Datasheet; ComponentLink1URL: https://www.yageo.com/upload/media/product/productsearch/datasheet/rchip/PYu-RC_Group_51_RoHS_L_10.pdf; ComponentLink2Description: DigiKey Link; ComponentLink2URL: https://www.digikey.com/en/products/detail/yageo/RC0603FR-07100KL/726889; Composition: Thick Film; Device Package: 0603 (1608 Metric); Features: Moisture Resistant; Height - Seated (Max): 0.022" (0.55mm); LastUpdated: 5/19/2023 7:41:17 PM; Lifecycle Status: Active; Minimum Order: 1; Number of Terminations: 2; Operating Temperature: -55°C ~ 155°C; Package / Case: 0603 (1608 Metric); Packaging: CutTape; PartId: 23948; Part Status: Active; Price: 0.01; Resistance: 100 kOhms; Series: RC_L; Size / Dimension: 0.063" L x 0.031" W (1.60mm x 0.80mm); Supplier 1: DigiKey; Supplier Part Number 1: 311-100KHRCT-ND; Supplier Device Package: 0603; Tolerance: ±1%
R9 = RC0402FR-07499RL: RES 499 OHM 1% 1/16W 0402; Manufacturer: Yageo; Power (Watts): 0.063W, 1/16W; Temperature Coefficient: ±100ppm/°C; Part Number: RC0402FR-07499RL; Value: 499 Ohms; ComponentLink1Description: Datasheet; ComponentLink1URL: https://www.yageo.com/upload/media/product/productsearch/datasheet/rchip/PYu-RC_Group_51_RoHS_L_10.pdf; ComponentLink2Description: DigiKey Link; ComponentLink2URL: https://www.digikey.com/en/products/detail/yageo/RC0402FR-07499RL/726623; Composition: Thick Film; Device Package: 0402 (1005 Metric); Features: Moisture Resistant; Height - Seated (Max): 0.016" (0.40mm); LastUpdated: 7/12/2023 7:23:15 PM; Lifecycle Status: Active; Minimum Order: 1; Number of Terminations: 2; Operating Temperature: -55°C ~ 155°C; Package / Case: 0402 (1005 Metric); Packaging: CutTape; PartId: 20564; Part Status: Active; Price: 0.01; Resistance: 499 Ohms; Series: RC_L; Size / Dimension: 0.039" L x 0.020" W (1.00mm x 0.50mm); Supplier 1: DigiKey; Supplier Part Number 1: 311-499LRCT-ND; Supplier Device Package: 0402; Tolerance: ±1%
R23 R25 R28 R30 = RC0603JR-130RL: RES 0 OHM JUMPER 1/10W 0603; Manufacturer: Yageo; Power (Watts): 0.1W, 1/10W; Resistance: 0 Ohms; Part Number: RC0603JR-130RL; Value: DNP; ComponentLink1Description: Datasheet; ComponentLink1URL: https://www.yageo.com/upload/media/product/productsearch/datasheet/rchip/PYu-RC_Group_51_RoHS_L_11.pdf; ComponentLink2Description: DigiKey Link; ComponentLink2URL: https://www.digikey.com/en/products/detail/yageo/RC0603JR-130RL/12756398; Composition: Thick Film; Device Package: 0603 (1608 Metric); Features: Moisture Resistant; Height - Seated (Max): 0.022" (0.55mm); LastUpdated: 5/18/2023 7:40:20 PM; Lifecycle Status: Active; Minimum Order: 1; Number of Terminations: 2; Operating Temperature: -55°C ~ 155°C; Package / Case: 0603 (1608 Metric); Packaging: CutTape; PartId: 65414; Part Status: Active; Price: 0.01; Series: RC_L; Size / Dimension: 0.063" L x 0.031" W (1.60mm x 0.80mm); Supplier 1: DigiKey; Supplier Part Number 1: 13-RC0603JR-130RLCT-ND; Supplier Device Package: 0603; Tolerance: Jumper
S1 S2 = KMR221GLFS: Switch Tactile N.O. SPST Button Gull Wing 0.05A 32VDC 1VA 200000Cycles 2N SMD Automotive T/R; manufacturer: C&K; Price: None; Value: *; Package: None; Availability: Unavailable; MP: KMR221GLFS; Part Number: KMR221GLFS; JLC part number: C72443
U1 = ESP32-S3R8: IC RF TxRx + MCU Bluetooth, WiFi 802.11b/g/n, Bluetooth v5.0 2.412GHz ~ 2.484GHz 56-VFQFN Exposed Pad; MF: Espressif Systems; Value: *; Check_prices: https://www.snapeda.com/parts/ESP32-S3R8/Espressif+Systems/view-part/?ref=eda; Digi-Key_Part_Number: 1904-ESP32-S3R8-ND; Package: None; Purchase-URL: https://pricing.snapeda.com/search/part/ESP32-S3R8/?ref=eda; SnapEDA_Link: https://www.snapeda.com/parts/ESP32-S3R8/Espressif+Systems/view-part/?ref=snap; MP: ESP32-S3R8; manufacturer: Espressif Systems; Part Number: ESP32-S3R8
U2 = MAX98357AETE+: Amplifier IC 1-Channel _Mono_ Class D 16-TQFN _3x3_; manufacturer: Analog Devices; MF: Maxim Integrated; Price: None; MP: MAX98357AETE+; Value: *; Package: TQFN-16 Maxim; SnapEDA_Link: https://www.snapeda.com/parts/MAX98357AETE%2B/Maxim%20Integrated/view-part/229145/?ref=snap; Availability: Unavailable; Part Number: MAX98357AETE+; JLC part number: C910544
U3 = W25Q128JVSIQ: FLASH - NOR Memory IC 128Mb (16M x 8) SPI - Quad I/O, QPI, DTR 133 MHz 8-SOIC; MF: Winbond Electronics; Price: None; Purchase-URL: https://pricing.snapeda.com/search/part/W25Q128JVSIQ/?ref=eda; Check_prices: https://www.snapeda.com/parts/W25Q128JVSIQ/Winbond+Electronics/view-part/?ref=eda; Value: *; MP: W25Q128JVSIQ; Package: SOIC-8 Winbond; SnapEDA_Link: https://www.snapeda.com/parts/W25Q128JVSIQ/Winbond+Electronics/view-part/?ref=snap; Availability: In Stock; manufacturer: Winbond Electronics; Part Number: W25Q128JVSIQ
Y1 = ABM11-40.000MHZ-12-B1U-T3: Crystal 40MHz Â±10ppm (Tol) Â±10ppm (Stability) 12pF FUND 60Ohm 4-Pin Ultra Mini-CSMD T/R; MF: Abracon Corporation; Package: None; Price: None; Check_prices: https://www.snapeda.com/parts/ABM11-40.000MHZ-12-B1U-T3/Abracon/view-part/?ref=eda; Value: *; SnapEDA_Link: https://www.snapeda.com/parts/ABM11-40.000MHZ-12-B1U-T3/Abracon/view-part/?ref=snap; MP: ABM11-40.000MHZ-12-B1U-T3; Availability: In Stock; Purchase-URL: https://pricing.snapeda.com/search?q=ABM11-40.000MHZ-12-B1U-T3&ref=eda; manufacturer: Abracon Corporation; Part Number: ABM11-40.000MHZ-12-B1U-T3; JLC part number: C255899